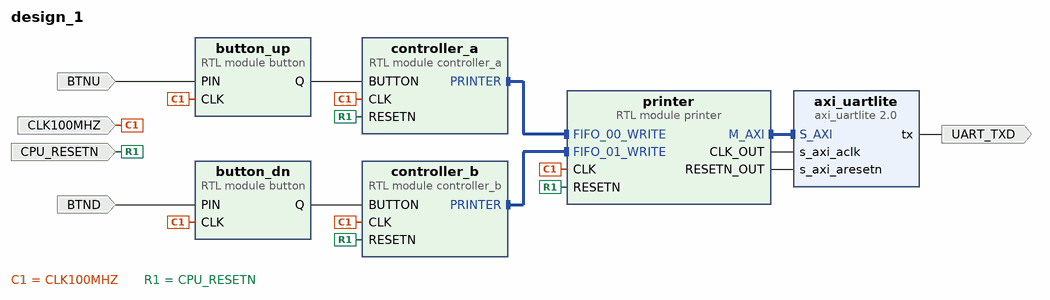
[diagram p0: block diagram of the top level]
# Vivado block design design_1, xc7a100tcsg324-1, Vivado 2021.2
create_bd_design design_1

create_bd_port -dir I -type rst CPU_RESETN
create_bd_port -dir I -type clk CLK100MHZ
create_bd_port -dir I BTNU
create_bd_port -dir I BTND
create_bd_port -dir O UART_TXD

create_bd_cell -type module -reference button button_up
create_bd_cell -type module -reference button button_dn
create_bd_cell -type ip -vlnv xilinx.com:ip:axi_uartlite:2.0 axi_uartlite
set_property -dict {CONFIG.C_BAUDRATE 115200} [get_bd_cells axi_uartlite]
create_bd_cell -type module -reference controller_a controller_a
create_bd_cell -type module -reference controller_b controller_b
create_bd_cell -type module -reference printer printer

# ---- connections ----

connect_bd_intf_net -intf_net controller_a_0_PRINTER [get_bd_intf_pins controller_a/PRINTER] [get_bd_intf_pins printer/FIFO_00_WRITE]
connect_bd_intf_net -intf_net controller_b_0_FIFO_WRITE [get_bd_intf_pins controller_b/PRINTER] [get_bd_intf_pins printer/FIFO_01_WRITE]
connect_bd_intf_net [get_bd_intf_pins printer/M_AXI] [get_bd_intf_pins axi_uartlite/S_AXI]
connect_bd_net [get_bd_ports CLK100MHZ] \
  [get_bd_pins button_up/CLK] [get_bd_pins button_dn/CLK] [get_bd_pins controller_a/CLK] [get_bd_pins controller_b/CLK] \
  [get_bd_pins printer/CLK]
connect_bd_net [get_bd_ports CPU_RESETN] [get_bd_pins controller_a/RESETN] [get_bd_pins controller_b/RESETN] [get_bd_pins printer/RESETN]
connect_bd_net -net PIN_0_1 [get_bd_ports BTNU] [get_bd_pins button_up/PIN]
connect_bd_net -net PIN_0_2 [get_bd_ports BTND] [get_bd_pins button_dn/PIN]
connect_bd_net -net axi_uartlite_0_tx [get_bd_pins axi_uartlite/tx] [get_bd_ports UART_TXD]
connect_bd_net -net btn_up_Q [get_bd_pins button_up/Q] [get_bd_pins controller_a/BUTTON]
connect_bd_net -net button_0_Q1 [get_bd_pins button_dn/Q] [get_bd_pins controller_b/BUTTON]
connect_bd_net [get_bd_pins printer/CLK_OUT] [get_bd_pins axi_uartlite/s_axi_aclk]
connect_bd_net [get_bd_pins printer/RESETN_OUT] [get_bd_pins axi_uartlite/s_axi_aresetn]

# ---- address map ----
assign_bd_address -offset 0x40600000 -range 64K -target_address_space [get_bd_addr_spaces printer/M_AXI] [get_bd_addr_segs axi_uartlite/S_AXI/Reg]

validate_bd_design
save_bd_design
